# Altium schematic sheet USB PD Controller.SchDoc
size 297 x 209 mm; CompanyName: Sainsbury Wellcome Centre; Organization: FabLab; Address1: Sainsbury Wellcome Centre; Address2: 25 Howland Street; Address3: London; Address4: W1T 4JG; DocumentNumber: 7; SheetNumber: 7; SheetTotal: 14; swcgroup: FabLab; Org: Sainsbury Wellcome Centre; Add1: 25 Howland Street; Add2: London; Add3: W1T 4JG; WebAddress: www.sainsburywellcome.org; SheetSize: A4; SheetName: USB PD Controller
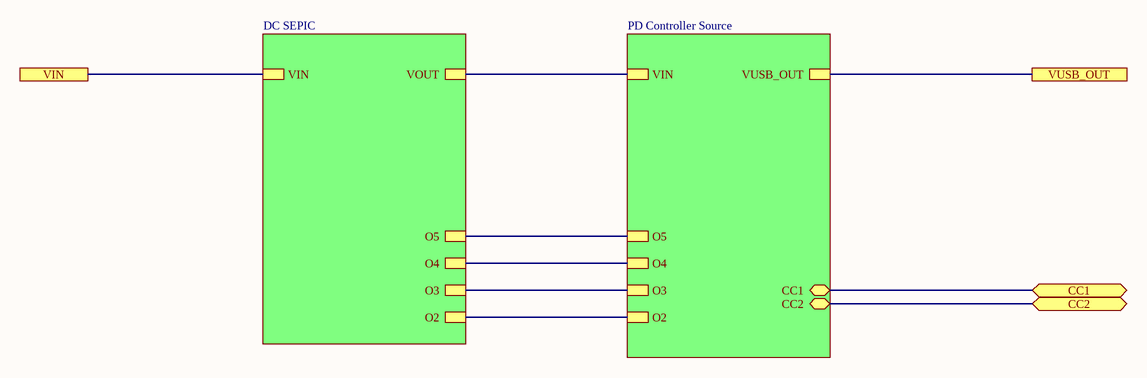
[diagram p0: USB PD Controller.SchDoc]

## Sub-sheets
DC SEPIC = DC SEPIC.SchDoc: VIN, VOUT, O5, O4, O3, O2
PD Controller Source = PD Controller Source.SchDoc: VIN, CC1 (bidir), CC2 (bidir), VUSB_OUT, O5, O4, O3, O2

## Ports
CC1 (bidir), CC2 (bidir), VIN, VUSB_OUT

## Nets
CC1: port CC1, sheet PD Controller Source/CC1
CC2: port CC2, sheet PD Controller Source/CC2
VIN: port VIN, sheet DC SEPIC/VIN
VUSB_OUT: port VUSB_OUT, sheet PD Controller Source/VUSB_OUT
(unnamed): sheet DC SEPIC/VOUT, sheet PD Controller Source/VIN
(unnamed): sheet DC SEPIC/O5, sheet PD Controller Source/O5
(unnamed): sheet DC SEPIC/O4, sheet PD Controller Source/O4
(unnamed): sheet DC SEPIC/O3, sheet PD Controller Source/O3
(unnamed): sheet DC SEPIC/O2, sheet PD Controller Source/O2

## Notes on the sheet
- FILE
- VARIANT
- DATE
- REVISION
- SHEET
- /
- PROJECT
- SIZE